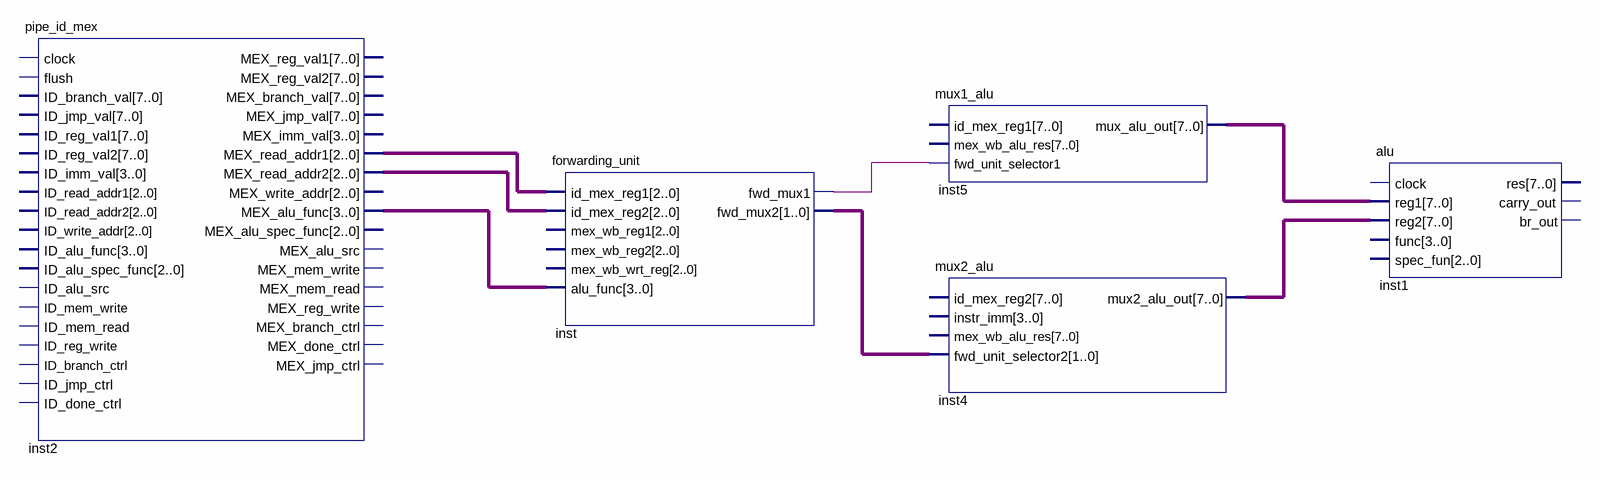
[diagram p0: schematic sheet]
// Quartus schematic ALU_Mux_Fwd.bdf as structural Verilog: 5 symbols, 0 pins
module ALU_Mux_Fwd (
);

  wire inst_fwd_mux1;
  wire [1:0] inst_fwd_mux2;
  wire [2:0] inst2_mex_read_addr1, inst2_mex_read_addr2;
  wire [3:0] inst2_mex_alu_func;
  wire [7:0] inst4_mux2_alu_out, inst5_mux_alu_out;

  pipe_id_mex inst2 (
    .MEX_read_addr1(inst2_mex_read_addr1), .MEX_read_addr2(inst2_mex_read_addr2),
    .MEX_alu_func(inst2_mex_alu_func));  // open: clock, flush, ID_branch_val, ID_jmp_val, ID_reg_val1, ID_reg_val2, ID_imm_val, ID_read_addr1, ID_read_addr2, ID_write_addr, ID_alu_func, ID_alu_spec_func, ID_alu_src, ID_mem_write, ID_mem_read, ID_reg_write, ID_branch_ctrl, ID_jmp_ctrl, ID_done_ctrl, MEX_reg_val1, MEX_reg_val2, MEX_branch_val, MEX_jmp_val, MEX_imm_val, MEX_write_addr, MEX_alu_spec_func, MEX_alu_src, MEX_mem_write, MEX_mem_read, MEX_reg_write, MEX_branch_ctrl, MEX_done_ctrl, MEX_jmp_ctrl
  forwarding_unit inst (
    .id_mex_reg1(inst2_mex_read_addr1), .id_mex_reg2(inst2_mex_read_addr2), .alu_func(inst2_mex_alu_func),
    .fwd_mux1(inst_fwd_mux1), .fwd_mux2(inst_fwd_mux2));  // open: mex_wb_reg1, mex_wb_reg2, mex_wb_wrt_reg
  mux1_alu inst5 (
    .fwd_unit_selector1(inst_fwd_mux1), .mux_alu_out(inst5_mux_alu_out));  // open: id_mex_reg1, mex_wb_alu_res
  mux2_alu inst4 (
    .fwd_unit_selector2(inst_fwd_mux2), .mux2_alu_out(inst4_mux2_alu_out));  // open: id_mex_reg2, instr_imm, mex_wb_alu_res
  alu inst1 (
    .reg1(inst5_mux_alu_out), .reg2(inst4_mux2_alu_out));  // open: clock, func, spec_fun, res, carry_out, br_out
endmodule
